# EAGLE design braids_v03_h405_upgrade (EAGLE 7.3.0)

## Sheet 1 of 2
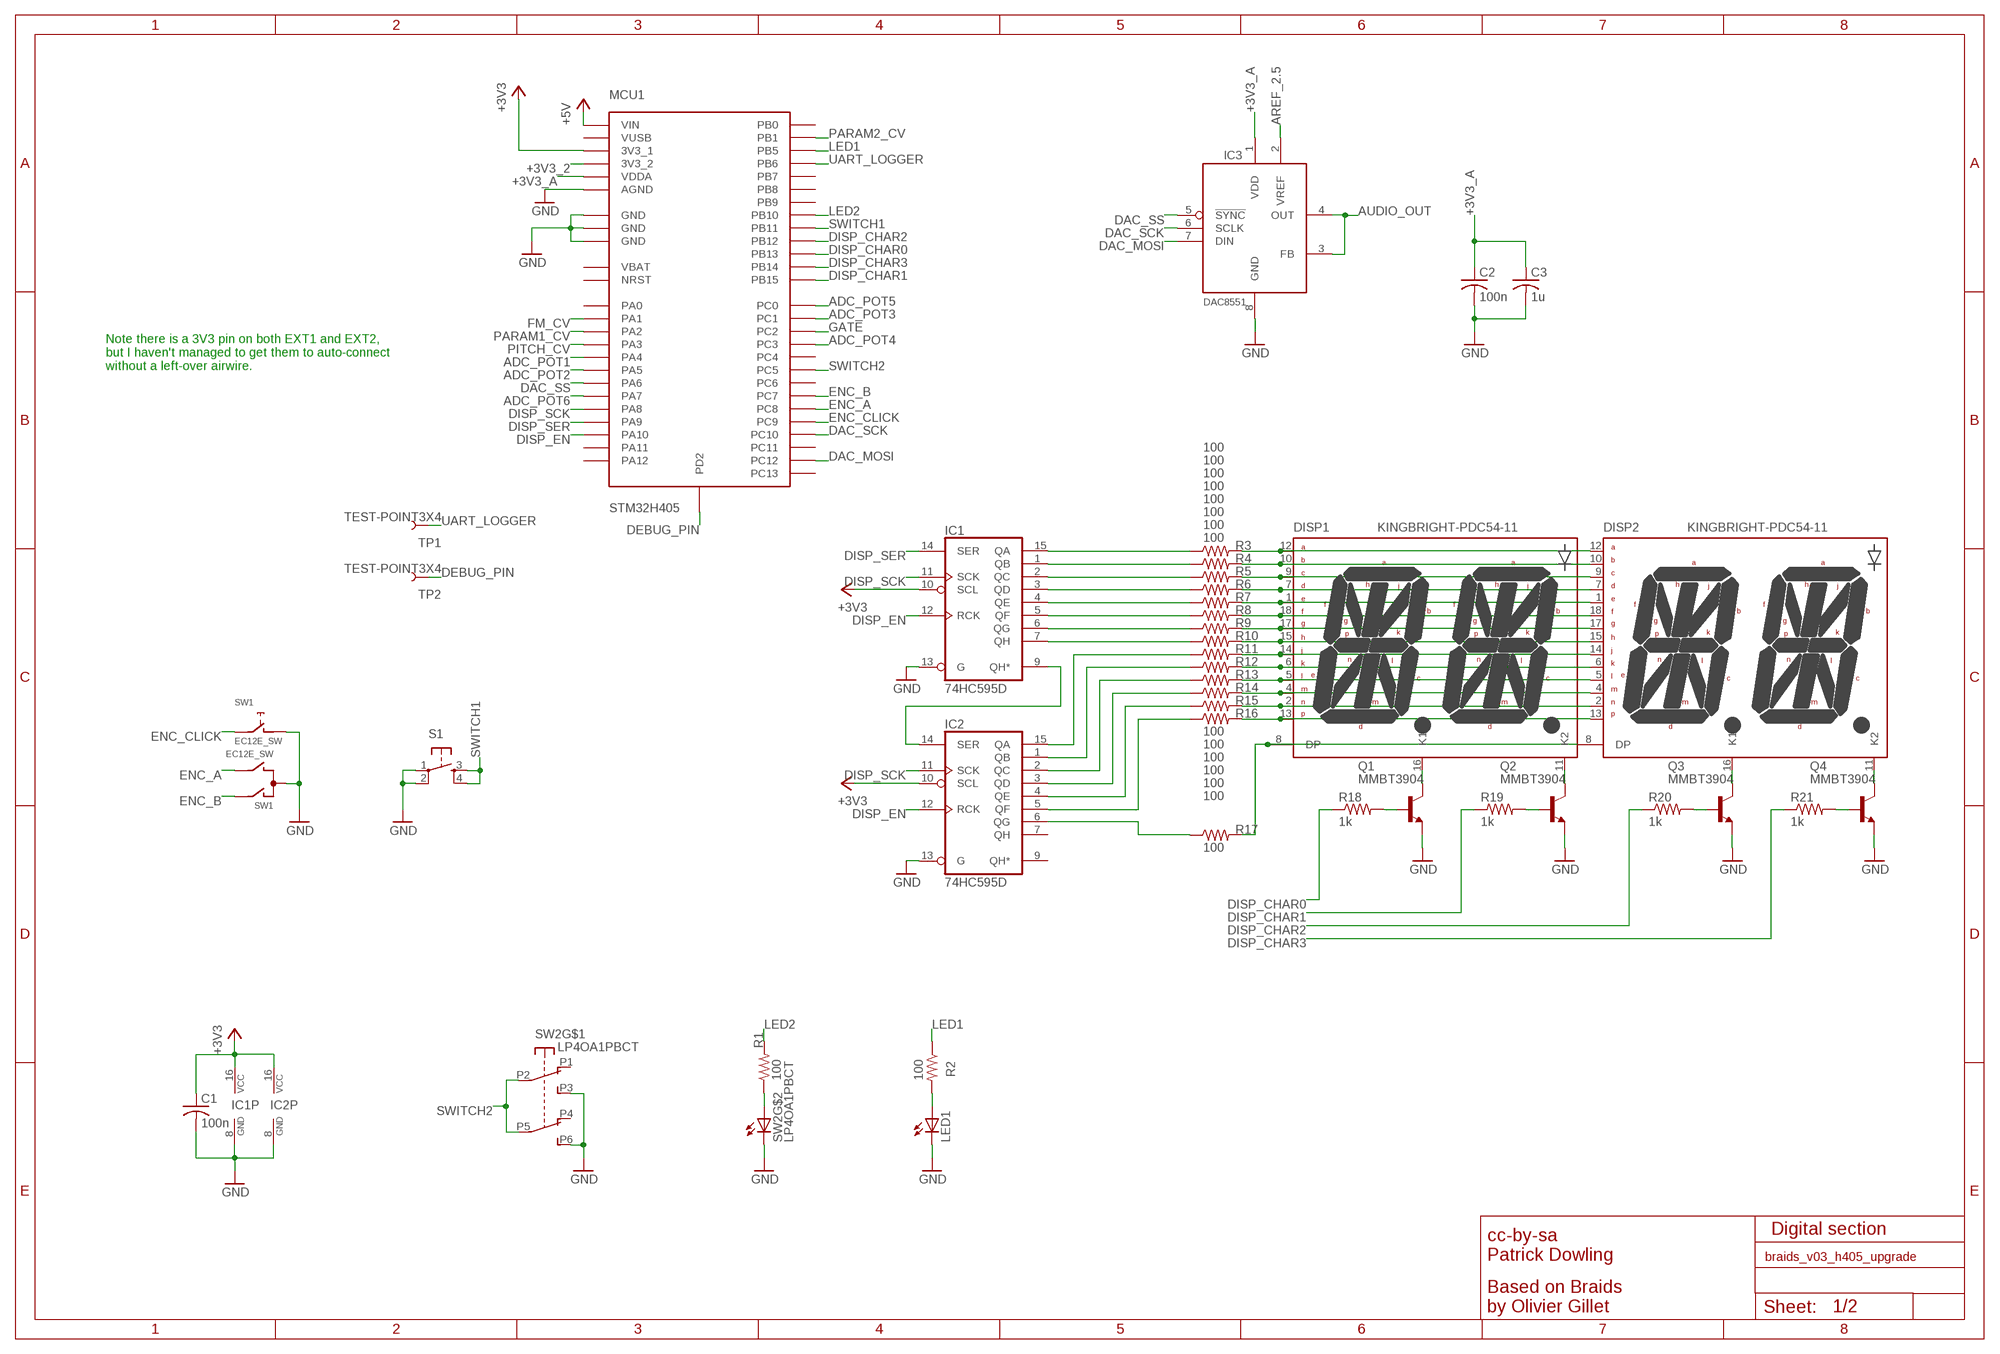
[diagram p0: schematic, sheet 1]

### Parts
C1  100n  C-USC0805  [C0805]
C2  100n  C-USC0805  [C0805]
C3  1u  C-USC0805  [C0805]
DISP1  KINGBRIGHT-PDC54-11  [PDC54]
DISP2  KINGBRIGHT-PDC54-11  [PDC54]
IC1  74HC595D  [SO16]
IC2  74HC595D  [SO16]
IC3  DAC8551  DAC855X  [MSOP-8]
LED1  LED3MM  [LED3MM]
MCU1  STM32H405  STM32H103  [STM32H103]
Q1  MMBT3904  MMBT3904LT1-NPN-SOT23-BEC  [SOT23-BEC]
Q2  MMBT3904  MMBT3904LT1-NPN-SOT23-BEC  [SOT23-BEC]
Q3  MMBT3904  MMBT3904LT1-NPN-SOT23-BEC  [SOT23-BEC]
Q4  MMBT3904  MMBT3904LT1-NPN-SOT23-BEC  [SOT23-BEC]
R1  100  R-US_R0805  [R0805]
R2  100  R-US_R0603  [R0603]
R3  100  R-US_R0603  [R0603]
R4  100  R-US_R0603  [R0603]
R5  100  R-US_R0603  [R0603]
R6  100  R-US_R0603  [R0603]
R7  100  R-US_R0603  [R0603]
R8  100  R-US_R0603  [R0603]
R9  100  R-US_R0603  [R0603]
R10  100  R-US_R0603  [R0603]
R11  100  R-US_R0603  [R0603]
R12  100  R-US_R0603  [R0603]
R13  100  R-US_R0603  [R0603]
R14  100  R-US_R0603  [R0603]
R15  100  R-US_R0603  [R0603]
R16  100  R-US_R0603  [R0603]
R17  100  R-US_R0603  [R0603]
R18  1k  R-US_R0603  [R0603]
R19  1k  R-US_R0603  [R0603]
R20  1k  R-US_R0603  [R0603]
R21  1k  R-US_R0603  [R0603]
S1  TAC_SWITCHPTH  [TACTILE-PTH]
SW1  EC12E_SW  [ALPS_EC12E_SW]
SW2  LP4OA1PBCT  [LP4OA1PBCT]
TP1  TEST-POINT3X4  [PAD.03X.04]
TP2  TEST-POINT3X4  [PAD.03X.04]

### Nets
+3V3: C1.1 IC1.10(SCL) IC1.16(VCC) IC2.10(SCL) IC2.16(VCC) MCU1.EXT1-5(3V3_1)
+3V3_2: MCU1.EXT2-5(3V3_2) ; also sheet 2
+3V3_A: C2.1 C3.1 IC3.1(VDD) MCU1.EXT2-1(VDDA) ; also sheet 2
+5V: MCU1.EXT2-26(VIN) ; also sheet 2
ADC_POT1: MCU1.EXT2-11(PA4) ; also sheet 2
ADC_POT2: MCU1.EXT1-18(PA5) ; also sheet 2
ADC_POT3: MCU1.EXT1-20(PC1) ; also sheet 2
ADC_POT4: MCU1.EXT2-9(PC3) ; also sheet 2
ADC_POT5: MCU1.EXT1-19(PC0) ; also sheet 2
ADC_POT6: MCU1.EXT1-22(PA7) ; also sheet 2
AREF_2.5: IC3.2(VREF) ; also sheet 2
AUDIO_OUT: IC3.3(FB) IC3.4(OUT) ; also sheet 2
DAC_MOSI: IC3.7(DIN) MCU1.EXT1-10(PC12)
DAC_SCK: IC3.6(SCLK) MCU1.EXT1-8(PC10)
DAC_SS: IC3.5(!SYNC) MCU1.EXT1-14(PA6)
DEBUG_PIN: MCU1.EXT1-11(PD2) TP2.P$1
DISP_CHAR0: MCU1.EXT2-16(PB13) R18.1
DISP_CHAR1: MCU1.EXT2-19(PB15) R19.1
DISP_CHAR2: MCU1.EXT2-17(PB12) R20.1
DISP_CHAR3: MCU1.EXT2-18(PB14) R21.1
DISP_EN: IC1.12(RCK) IC2.12(RCK) MCU1.EXT1-7(PA10)
DISP_SCK: IC1.11(SCK) IC2.11(SCK) MCU1.EXT1-2(PA8)
DISP_SER: IC1.14(SER) MCU1.EXT1-4(PA9)
ENC_A: MCU1.EXT2-22(PC8) SW1.B
ENC_B: MCU1.EXT2-21(PC7) SW1.A
ENC_CLICK: MCU1.EXT2-24(PC9) SW1.E
FM_CV: MCU1.EXT2-8(PA1) ; also sheet 2
GATE: MCU1.EXT2-2(PC2) ; also sheet 2
GND: C1.2 C2.2 C3.2 IC1.8(GND) IC1.13(G) IC2.8(GND) IC2.13(G) IC3.8(GND) LED1.K(C) MCU1.EXT1-6(GND) MCU1.EXT2-3(AGND) MCU1.EXT2-6(GND) MCU1.EXT2-25(GND) Q1.E Q2.E Q3.E Q4.E S1.1 S1.2 SW1.C SW1.D SW2.L2 SW2.P3(A3) SW2.P6(B3) ; also sheet 2
LED1: MCU1.EXT1-12(PB5) R2.1
LED2: MCU1.EXT2-14(PB10) R1.2
N$1: DISP1.16(K1) Q1.C
N$2: DISP1.11(K2) Q2.C
N$3: DISP2.16(K1) Q3.C
N$4: DISP2.11(K2) Q4.C
N$5: Q1.B R18.2
N$6: Q2.B R19.2
N$9: Q3.B R20.2
N$10: Q4.B R21.2
N$15: DISP1.12(A) DISP2.12(A) R3.2
N$16: DISP1.10(B) DISP2.10(B) R4.2
N$17: DISP1.9(C) DISP2.9(C) R5.2
N$18: DISP1.7(D) DISP2.7(D) R6.2
N$19: DISP1.1(E) DISP2.1(E) R7.2
N$20: DISP1.18(F) DISP2.18(F) R8.2
N$21: DISP1.17(G) DISP2.17(G) R9.2
N$22: DISP1.15(H) DISP2.15(H) R10.2
N$23: DISP1.14(J) DISP2.14(J) R11.2
N$24: DISP1.6(K) DISP2.6(K) R12.2
N$25: DISP1.5(L) DISP2.5(L) R13.2
N$26: DISP1.4(M) DISP2.4(M) R14.2
N$27: DISP1.2(N) DISP2.2(N) R15.2
N$28: DISP1.13(P) DISP2.13(P) R16.2
N$29: DISP1.8(DP) DISP2.8(DP) R17.2
N$30: IC1.7(QH) R10.1
N$31: IC1.9(QH*) IC2.14(SER)
N$32: IC1.15(QA) R3.1
N$33: IC1.1(QB) R4.1
N$34: IC1.2(QC) R5.1
N$35: IC1.3(QD) R6.1
N$36: IC1.4(QE) R7.1
N$37: IC1.5(QF) R8.1
N$38: IC1.6(QG) R9.1
N$39: IC2.15(QA) R11.1
N$40: IC2.1(QB) R12.1
N$41: IC2.2(QC) R13.1
N$42: IC2.3(QD) R14.1
N$43: IC2.4(QE) R15.1
N$44: IC2.5(QF) R16.1
N$46: IC2.6(QG) R17.1
N$47: LED1.A R2.2
N$48: R1.1 SW2.L1
PARAM1_CV: MCU1.EXT2-7(PA2) ; also sheet 2
PARAM2_CV: MCU1.EXT1-26(PB1) ; also sheet 2
PITCH_CV: MCU1.EXT2-10(PA3) ; also sheet 2
SWITCH1: MCU1.EXT2-15(PB11) S1.3 S1.4
SWITCH2: MCU1.EXT2-13(PC5) SW2.P2(A2) SW2.P5(B2)
UART_LOGGER: MCU1.EXT1-13(PB6) TP1.P$1
Unconnected: IC2.7(QH) IC2.9(QH*) MCU1.EXT1-1(PA11) MCU1.EXT1-3(PA12) MCU1.EXT1-9(PC11) MCU1.EXT1-15(PB7) MCU1.EXT1-16(PB8) MCU1.EXT1-17(PB9) MCU1.EXT1-21(PB0) MCU1.EXT1-23(VBAT) MCU1.EXT1-24(PC13) MCU1.EXT1-25(NRST) MCU1.EXT2-4(PA0) MCU1.EXT2-12(PC4) MCU1.EXT2-20(PC6) MCU1.EXT2-23(VUSB) SW1.GND1(G) SW1.GND2(G) SW2.P1(A1) SW2.P4(B1)

### Notes on the sheet
- Note there is a 3V3 pin on both EXT1 and EXT2,
  but I haven't managed to get them to auto-connect
  without a left-over airwire.
- Digital section
- cc-by-sa
  Patrick Dowling
- Based on Braids
  by Olivier Gillet

## Sheet 2 of 2
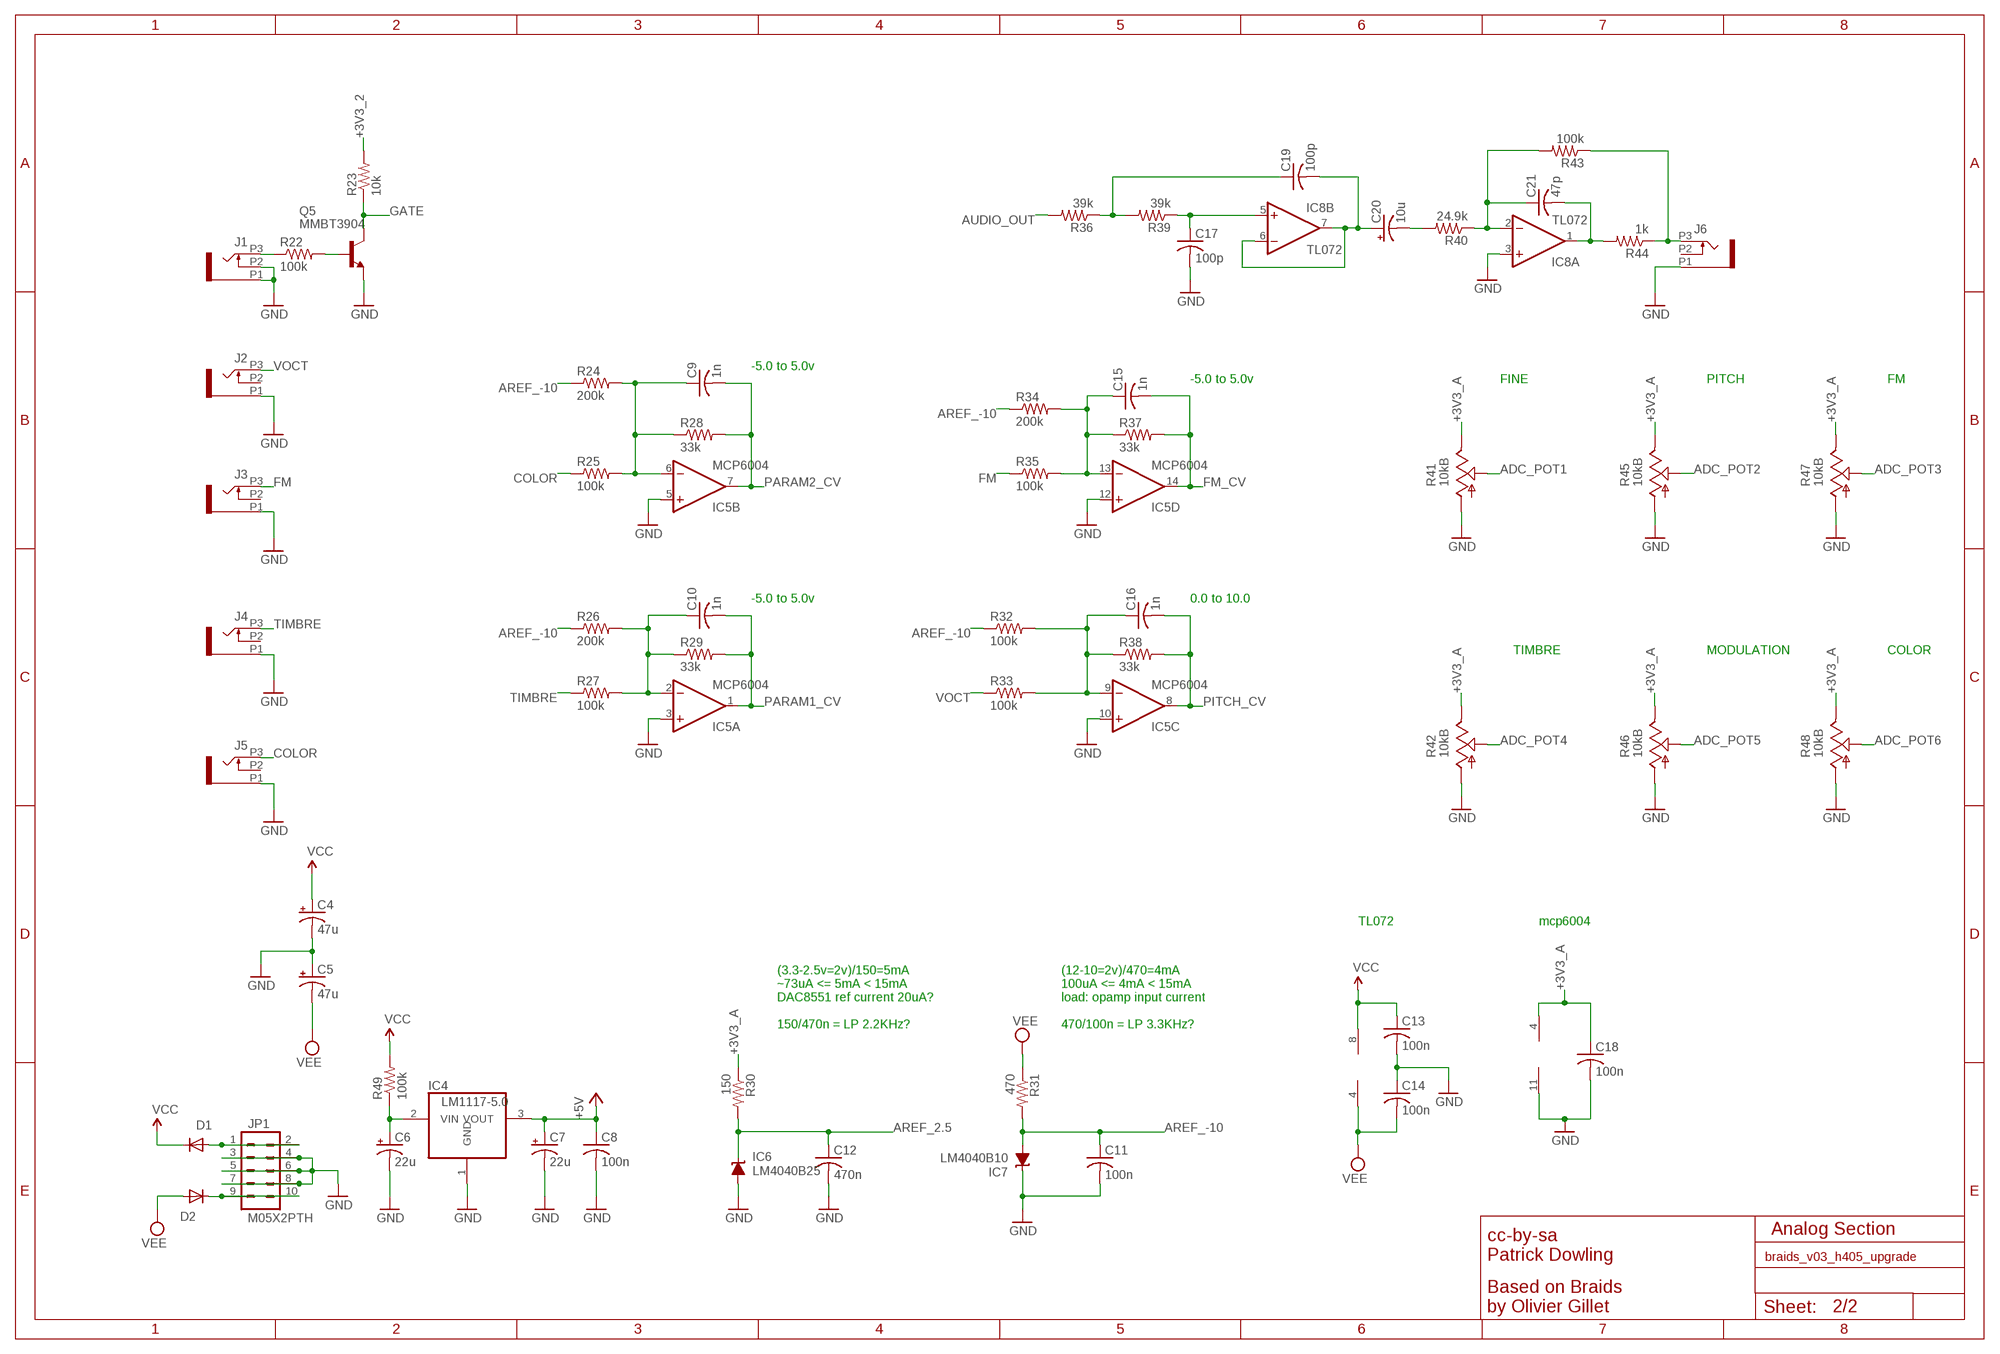
[diagram p1: schematic, sheet 2]

### Parts
C4  47u  CPOL-USD  [PANASONIC_D]
C5  47u  CPOL-USD  [PANASONIC_D]
C6  22u  CPOL-USC  [PANASONIC_C]
C7  22u  CPOL-USC  [PANASONIC_C]
C8  100n  C-USC0805  [C0805]
C9  1n  C-USC0805  [C0805]
C10  1n  C-USC0805  [C0805]
C11  100n  C-USC0805  [C0805]
C12  470n  C-USC0805  [C0805]
C13  100n  C-USC0805  [C0805]
C14  100n  C-USC0805  [C0805]
C15  1n  C-USC0805  [C0805]
C16  1n  C-USC0805  [C0805]
C17  100p  C-USC0805  [C0805]
C18  100n  C-USC0805  [C0805]
C19  100p  C-USC0805  [C0805]
C20  10u  CPOL-USE2-5  [E2-5]
C21  47p  C-USC0805  [C0805]
D1  1N5819HW  DIODE-SOD123  [SOD123]
D2  1N5819HW  DIODE-SOD123  [SOD123]
IC4  LM1117-5.0  REG1117T  [TO252]
IC5  MCP6004  TL074D  [SO14]
IC6  LM4040B25  LM4041B12DBZ  [DBZ_R-PDSO-G3]
IC7  LM4040B10  LM4041B12DBZ  [DBZ_R-PDSO-G3]
IC8  TL072  TL072D  [SO08]
J1  PJ301_THONKICONN6  [WQP_PJ_301M6]
J2  PJ301_THONKICONN6  [WQP_PJ_301M6]
J3  PJ301_THONKICONN6  [WQP_PJ_301M6]
J4  PJ301_THONKICONN6  [WQP_PJ_301M6]
J5  PJ301_THONKICONN6  [WQP_PJ_301M6]
J6  PJ301_THONKICONN6  [WQP_PJ_301M6]
JP1  M05X2PTH  [AVR_ICSP]
Q5  MMBT3904  MMBT3904LT1-NPN-SOT23-BEC  [SOT23-BEC]
R22  100k  R-US_R0805  [R0805]
R23  10k  R-US_R0805  [R0805]
R24  200k  R-US_R0805  [R0805]
R25  100k  R-US_R0805  [R0805]
R26  200k  R-US_R0805  [R0805]
R27  100k  R-US_R0805  [R0805]
R28  33k  R-US_R0805  [R0805]
R29  33k  R-US_R0805  [R0805]
R30  150  R-US_R0805  [R0805]
R31  470  R-US_R0805  [R0805]
R32  100k  R-US_R0805  [R0805]
R33  100k  R-US_R0805  [R0805]
R34  200k  R-US_R0805  [R0805]
R35  100k  R-US_R0805  [R0805]
R36  39k  R-US_R0805  [R0805]
R37  33k  R-US_R0805  [R0805]
R38  33k  R-US_R0805  [R0805]
R39  39k  R-US_R0805  [R0805]
R40  24.9k  R-US_R0805  [R0805]
R41  10kB  POT_USVERTICAL_PS  [ALPS_POT_VERTICAL_PS]
R42  10kB  POT_USVERTICAL_PS  [ALPS_POT_VERTICAL_PS]
R43  100k  R-US_R0805  [R0805]
R44  1k  R-US_R0805  [R0805]
R45  10kB  POT_USVERTICAL_PS  [ALPS_POT_VERTICAL_PS]
R46  10kB  POT_USVERTICAL_PS  [ALPS_POT_VERTICAL_PS]
R47  10kB  POT_USVERTICAL_PS  [ALPS_POT_VERTICAL_PS]
R48  10kB  POT_USVERTICAL_PS  [ALPS_POT_VERTICAL_PS]
R49  100k  R-US_R1206  [R1206]

### Nets
+3V3_2: R23.2 ; also sheet 1
+3V3_A: C18.1 IC5.4(P:V+) R30.1 R41.P$1(E) R42.P$1(E) R45.P$1(E) R46.P$1(E) R47.P$1(E) R48.P$1(E) ; also sheet 1
+5V: C7.+ C8.1 IC4.3(VOUT) ; also sheet 1
ADC_POT1: R41.P$2(S) ; also sheet 1
ADC_POT2: R45.P$2(S) ; also sheet 1
ADC_POT3: R47.P$2(S) ; also sheet 1
ADC_POT4: R42.P$2(S) ; also sheet 1
ADC_POT5: R46.P$2(S) ; also sheet 1
ADC_POT6: R48.P$2(S) ; also sheet 1
AREF_2.5: C12.1 IC6.1(C) R30.2 ; also sheet 1
AREF_-10: C11.1 IC7.2(A) R24.1 R26.1 R31.2 R32.1 R34.1
AUDIO_OUT: R36.2 ; also sheet 1
COLOR: J5.P3 R25.1
FM: J3.P3 R35.1
FM_CV: C15.2 IC5.14(D:OUT) R37.2 ; also sheet 1
GATE: Q5.C R23.1 ; also sheet 1
GATE_IN: Q5.B R22.2
GND: C4.- C5.+ C6.- C7.- C8.2 C11.2 C12.2 C13.2 C14.1 C17.2 C18.2 IC4.1(GND) IC5.3(A:+IN) IC5.5(B:+IN) IC5.10(C:+IN) IC5.11(P:V-) IC5.12(D:+IN) IC6.2(A) IC7.1(C) IC8.3(A:+IN) J1.P1 J1.P2 J2.P1 J3.P1 J4.P1 J5.P1 J6.P1 JP1.3 JP1.4 JP1.5 JP1.6 JP1.7 JP1.8 Q5.E R41.P$3(A) R42.P$3(A) R45.P$3(A) R46.P$3(A) R47.P$3(A) R48.P$3(A) ; also sheet 1
N$7: C6.+ IC4.2(VIN) R49.1
N$13: D2.C JP1.9 JP1.10
N$14: D1.A JP1.1 JP1.2
N$45: C9.1 IC5.6(B:-IN) R24.2 R25.2 R28.1
N$50: C15.1 IC5.13(D:-IN) R34.2 R35.2 R37.1
N$52: C10.1 IC5.2(A:-IN) R26.2 R27.2 R29.1
N$57: J1.P3 R22.1
N$63: C16.1 IC5.9(C:-IN) R32.2 R33.2 R38.1
N$67: C19.2 C20.+ IC8.6(B:-IN) IC8.7(B:OUT)
N$68: C20.- R40.2
N$69: C17.1 IC8.5(B:+IN) R39.1
N$71: C19.1 R36.1 R39.2
N$72: J6.P3 R43.1 R44.1
N$73: C21.2 IC8.1(A:OUT) R44.2
N$75: C21.1 IC8.2(A:-IN) R40.1 R43.2
PARAM1_CV: C10.2 IC5.1(A:OUT) R29.2 ; also sheet 1
PARAM2_CV: C9.2 IC5.7(B:OUT) R28.2 ; also sheet 1
PITCH_CV: C16.2 IC5.8(C:OUT) R38.2 ; also sheet 1
TIMBRE: J4.P3 R27.1
VCC: C4.+ C13.1 D1.C IC8.8(P:V+) R49.2
VEE: C5.- C14.2 D2.A IC8.4(P:V-) R31.1
VOCT: J2.P3 R33.1
Unconnected: J2.P2 J3.P2 J4.P2 J5.P2 J6.P2

### Notes on the sheet
- -5.0 to 5.0v
- -5.0 to 5.0v | FINE | PITCH | FM
- -5.0 to 5.0v | 0.0 to 10.0
- TIMBRE | MODULATION | COLOR
- TL072 | mcp6004
- (3.3-2.5v=2v)/150=5mA
  ~73uA <= 5mA < 15mA
  DAC8551 ref current 20uA?
  
  150/470n = LP 2.2KHz?
- (12-10=2v)/470=4mA
  100uA <= 4mA < 15mA
  load: opamp input current
  
  470/100n = LP 3.3KHz?
- Analog Section
- cc-by-sa
  Patrick Dowling
- Based on Braids
  by Olivier Gillet

## Library data of the parts
C1-C3 C8-C19 C21 = rcl:C-US: CAPACITOR, American symbol
C4-C7 C20 = rcl:CPOL-US: POLARIZED CAPACITOR, American symbol
D1 D2 = diode:DIODE-: DIODE
DISP1 DISP2 = og-display:KINGBRIGHT-PDC54-11: Kingbright PDC54-11GWA ; also compatible with LITE-On LTP-3784G or Avago HDSP-A27C
IC1 IC2 = 74xx-eu:74*595: 8-bit SHIFT REGISTER, output latch
IC3 = og-dac:DAC855X: 16-bit low-glitch DAC with 2's complement (8550) or unsigned code (8551)
IC4 = og-vreg:REG1117: 800mA and 1A Low Dropout (LDO) Positive Regulator 1.8V, 2.5V, 2.85V, 3.3V, 5V, and Adj
IC5 = gm-ics:TL074: OP AMP
IC6 IC7 = texas:LM4041: PRECISION MICROPOWER SHUNT VOLTAGE REFERENCE Source: http://focus.ti.com/lit/ds/slcs146e/slcs146e.pdf
IC8 = linear:TL072: OP AMP
J1-J6 = og-pj301:PJ301_THONKICONN
JP1 = og-header:M05X2: Header 5x2 Standard 10-pin dual row 0.1" header. Commonly used with AVR-ISP. Use with Spark Fun Electronics SKU: PRT-00778
LED1 = led:LED: LED OSRAM: - CHIPLED LG R971, LG N971, LY N971, LG Q971, LY Q971, LO R971, LY R971 LH N974, LH R974 LS Q976, LO Q976, LY Q976 LO Q996 - Hyper CHIPLED LW Q18S LB Q993, LB Q99A, LB R99A - SideLED LS A670, LO A670, LY A670, LG A670, LP A670 LB A673, LV A673, LT A673, LW A673 LH A674 LY A675 LS A676, LA A676, LO A676, LY A676, LW A676 LS A679, LY A679, LG A679 - Hyper Micro SIDELED® LS Y876, LA Y876, LO Y876, LY Y876 LT Y87S - SmartLED LW L88C, LW L88S LB L89C, LB L89S, LG L890 LS L89K, LO L89K, LY L89K LS L896, LA L896, LO L896, LY L896 - TOPLED LS T670, LO T670, LY T670, LG T670, LP T670 LSG T670, LSP T670, LSY T670, LOP T670, LYG T670 LG T671, LOG T671, LSG T671 LB T673, LV T673, LT T673, LW T673 LH T674 LS T676, LA T676, LO T676, LY T676, LB T676, LH T676, LSB T676, LW T676 LB T67C, LV T67C, LT T67C, LS T67K, LO T67K, LY T67K, LW E67C LS E67B, LA E67B, LO E67B, LY E67B, LB E67C, LV E67C, LT E67C LW T67C LS T679, LY T679, LG T679 LS T770, LO T770, LY T770, LG T770, LP T770 LB T773, LV T773, LT T773, LW T773 LH T774 LS E675, LA E675, LY E675, LS T675 LS T776, LA T776, LO T776, LY T776, LB T776 LHGB T686 LT T68C, LB T68C - Hyper Mini TOPLED® LB M676 - Mini TOPLED Santana® LG M470 LS M47K, LO M47K, LY M47K Source: http://www.osram.convergy.de LUXEON: - LUMILED® LXK2-PW12-R00, LXK2-PW12-S00, LXK2-PW14-U00, LXK2-PW14-V00 LXK2-PM12-R00, LXK2-PM12-S00, LXK2-PM14-U00 LXK2-PE12-Q00, LXK2-PE12-R00, LXK2-PE12-S00, LXK2-PE14-T00, LXK2-PE14-U00 LXK2-PB12-K00, LXK2-PB12-L00, LXK2-PB12-M00, LXK2-PB14-N00, LXK2-PB14-P00, LXK2-PB14-Q00 LXK2-PR12-L00, LXK2-PR12-M00, LXK2-PR14-Q00, LXK2-PR14-R00 LXK2-PD12-Q00, LXK2-PD12-R00, LXK2-PD12-S00 LXK2-PH12-R00, LXK2-PH12-S00 LXK2-PL12-P00, LXK2-PL12-Q00, LXK2-PL12-R00 Source: www.luxeon.com KINGBRIGHT: KA-3528ASYC Source: www.kingbright.com
MCU1 = olimex-stm32h:STM32H103: Olimex STM32H103 and H405
Q1-Q5 = transistor:*-NPN-: NPN Transistror BF959 corrected 2008.03.06
R1-R40 R43 R44 R49 = rcl:R-US_: RESISTOR, American symbol
R41 R42 R45-R48 = pot-alps:POT_US
S1 = SparkFun:TAC_SWITCH: Momentary Switch Button commonly used for reset or general input. Spark Fun Electronics SKU : COM-00097
SW1 = og-encoder:EC12E_SW: ALPS rotary Encoder EC12E series with switch
SW2 = og-switch:LP4OA1PBCT
TP1 TP2 = SparkFun-Passives:TEST-POINT: Bare copper test points for troubleshooting or ICT

## Board
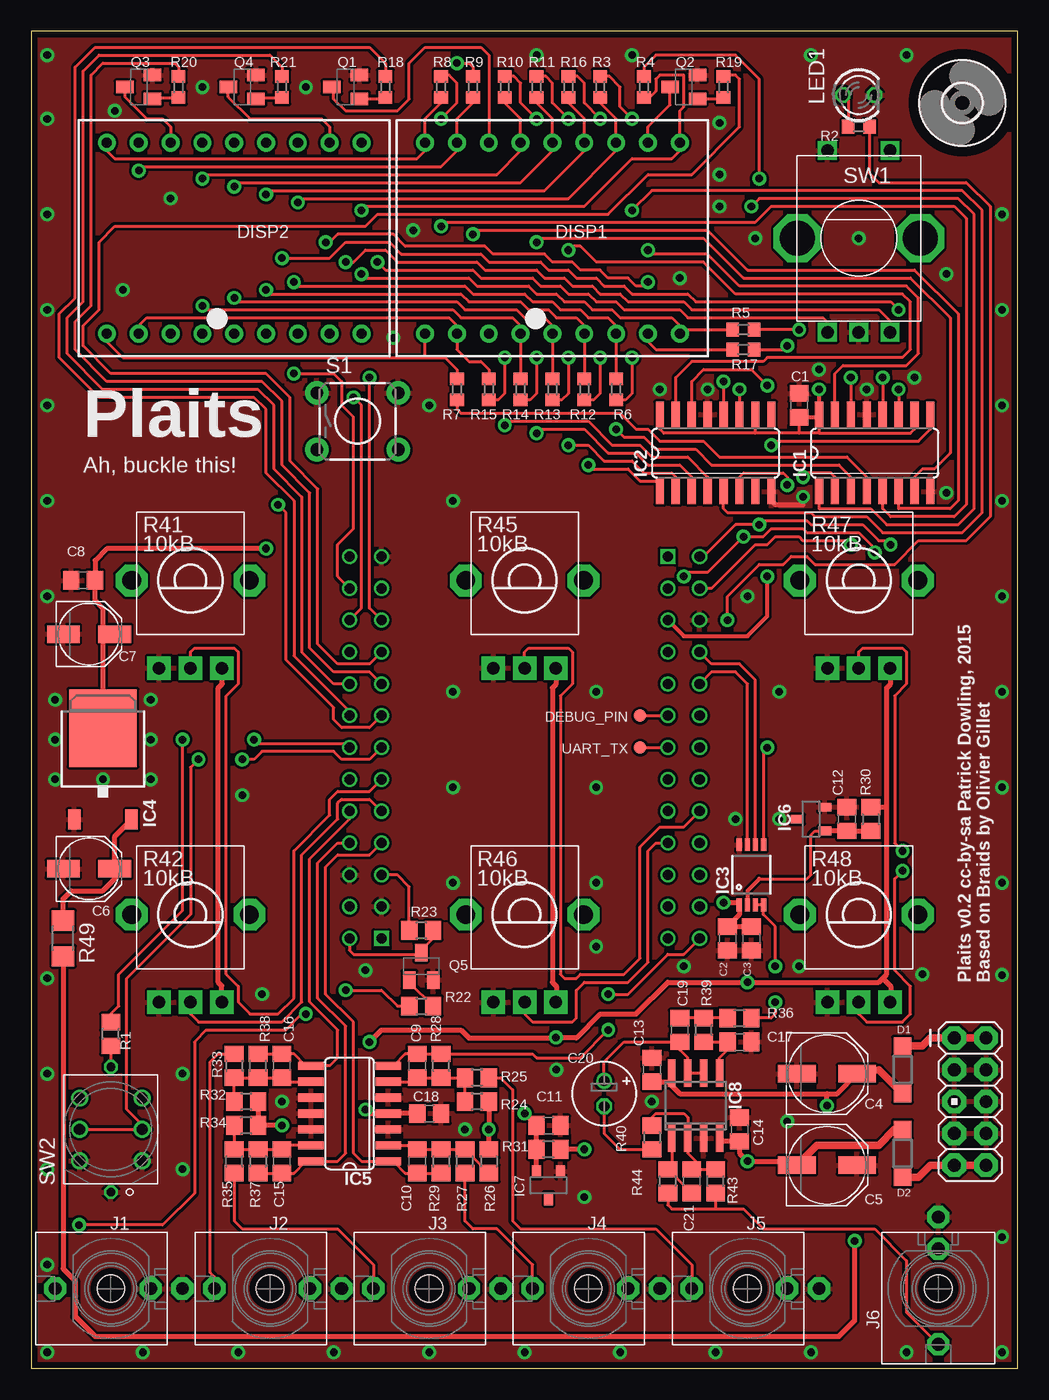
[diagram p2: board, top side]
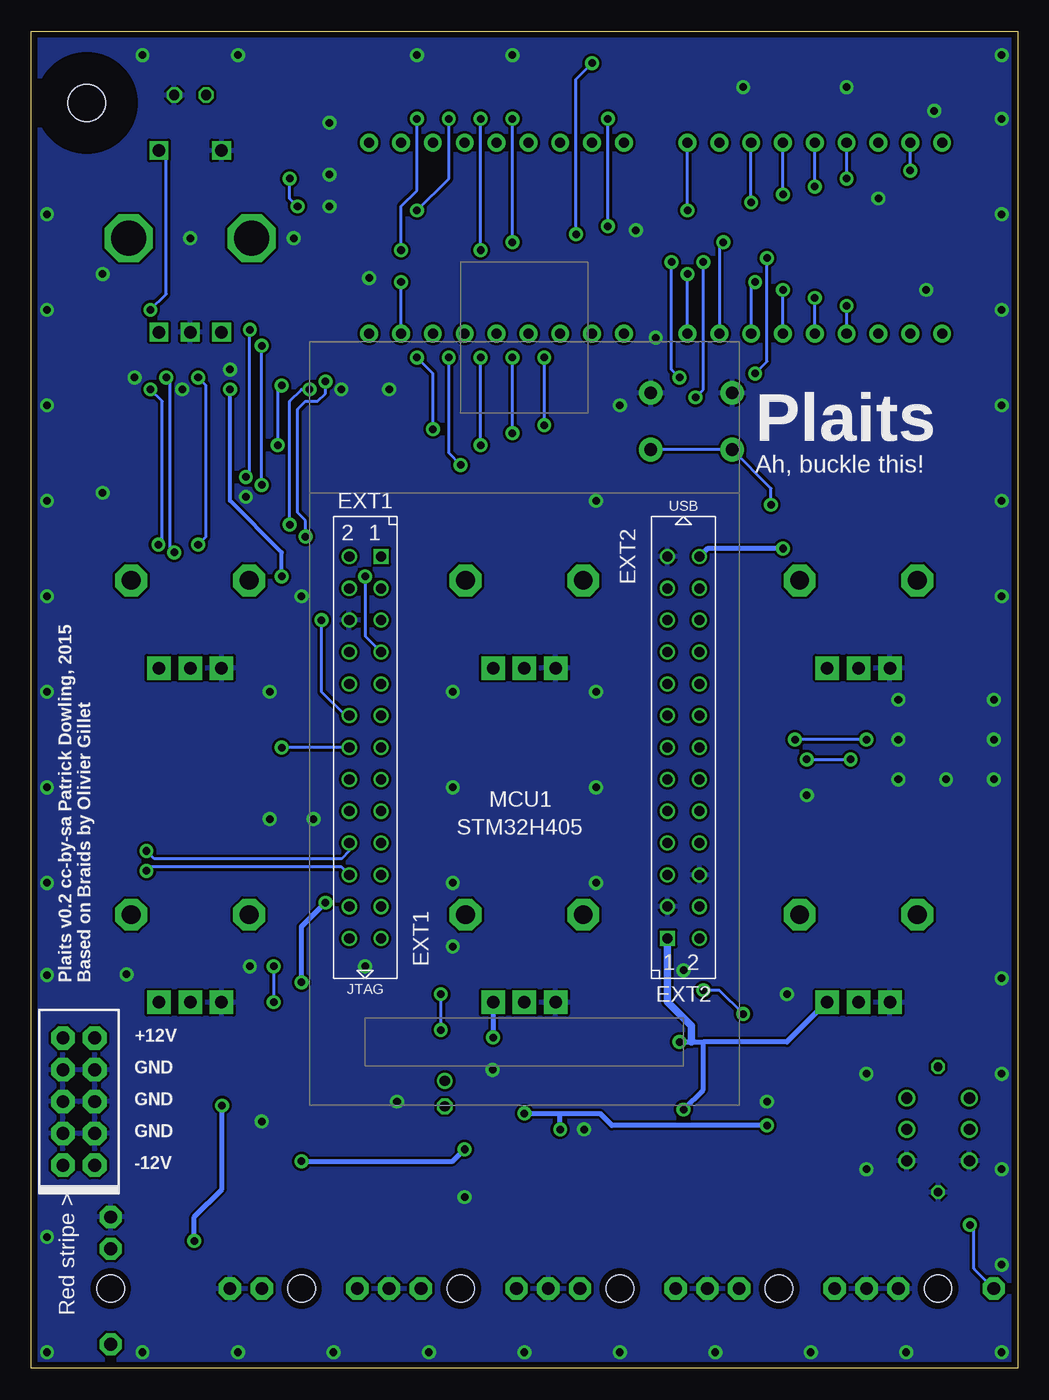
[diagram p3: board, bottom side, seen from below]

Size 78.72 x 106.68 mm. Coordinates in mm from the lower left corner, seen from the top.
Outline: 0,0 78.72,0 78.72,106.68 0,106.68 0,0
Copper layers (1*16): Top 0.035mm / dielectric 1.5mm / Bottom 0.035mm
Design rules "PCBCart-Standard *": minimum track width 8mil, minimum drill 0.4mm, track to track 8mil, track to pad 8mil, pad to pad 8mil, via to via 8mil, smd to smd 8mil, copper to edge 20mil, drill to drill 8mil, minimum pad ring 8mil, minimum via ring 10mil, stop-mask expansion 3mil, vias tented up to drill 25mil, thermal gap 8mil

### Footprints (pad centres in the part's own frame; a part is rotated, then mirrored left to right if it is on the bottom)
C0805 = smd 1.3 x 1.5: 1 -0.95,0; 2 0.95,0
PANASONIC_D = smd 3 x 1.4: + 2.4,0; - -2.4,0
PANASONIC_C = smd 2.6 x 1.4: + 2.05,0; - -2.05,0
E2-5 = drill 0.813 pad 1.27: + -1.016,0 | drill 0.813 pad 1.27 octagon: - 1.016,0
SOD123 = smd 1.4 x 1.4: A 1.9,0; C -1.9,0
PDC54 = drill 0.8 pad 1.422: 1 -10.16,-7.62; 2 -7.62,-7.62; 3 -5.08,-7.62; 4 -2.54,-7.62; 5 0,-7.62; 6 2.54,-7.62; 7 5.08,-7.62; 8 7.62,-7.62; 9 10.16,-7.62; 10 10.16,7.62; 11 7.62,7.62; 12 5.08,7.62; 13 2.54,7.62; 14 0,7.62; 15 -2.54,7.62; 16 -5.08,7.62; 17 -7.62,7.62; 18 -10.16,7.62
SO16 = smd 0.66 x 2.032: 1 -4.445,-3.073; 2 -3.175,-3.073; 3 -1.905,-3.073; 4 -0.635,-3.073; 5 0.635,-3.073; 6 1.905,-3.073; 7 3.175,-3.073; 8 4.445,-3.073; 9 4.445,3.073; 10 3.175,3.073; 11 1.905,3.073; 12 0.635,3.073; 13 -0.635,3.073; 14 -1.905,3.073; 15 -3.175,3.073; 16 -4.445,3.073
MSOP-8 = smd 0.41 x 1.02: 1 -0.975,-2.4; 2 -0.325,-2.4; 3 0.325,-2.4; 4 0.975,-2.4; 5 0.975,2.4; 6 0.325,2.4; 7 -0.325,2.4; 8 -0.975,2.4
TO252 = smd 1 x 1.6: 1 -2.28,-4.8; 2 2.28,-4.8 | smd 5.4 x 6.2: 3 0,2.5
SO14 = smd 0.66 x 2.032: 1 -3.81,-3.073; 2 -2.54,-3.073; 3 -1.27,-3.073; 4 0,-3.073; 5 1.27,-3.073; 6 2.54,-3.073; 7 3.81,-3.073; 8 3.81,3.073; 9 2.54,3.073; 10 1.27,3.073; 11 0,3.073; 12 -1.27,3.073; 13 -2.54,3.073; 14 -3.81,3.073
DBZ_R-PDSO-G3 = smd 0.7 x 1: 1 -0.95,-1.1; 2 0.95,-1.1; 3 0,1.1
SO08 = smd 0.6 x 2.2: 1 -1.905,-2.6; 2 -0.635,-2.6; 3 0.635,-2.6; 4 1.905,-2.6; 5 1.905,2.6; 6 0.635,2.6; 7 -0.635,2.6; 8 -1.905,2.6
WQP_PJ_301M6 = drill 1.016 pad 1.778 octagon: P1 0,-5.715; P2 0,-3.175; P3 0,4.445 | hole 2.2: 0,0
AVR_ICSP = drill 1.016 pad 1.88 octagon: 1 -1.27,5.08; 2 1.27,5.08; 3 -1.27,2.54; 4 1.27,2.54; 5 -1.27,0; 6 1.27,0; 7 -1.27,-2.54; 8 1.27,-2.54; 9 -1.27,-5.08; 10 1.27,-5.08
LED3MM = drill 0.813 octagon: A -1.27,0; K 1.27,0
STM32H103 = drill 0.8 square: EXT1-1 11.43,-15.24; EXT2-1 -11.43,15.24 | drill 0.8: EXT1-2 13.97,-15.24; EXT1-3 11.43,-12.7; EXT1-4 13.97,-12.7; EXT1-5 11.43,-10.16; EXT1-6 13.97,-10.16; EXT1-7 11.43,-7.62; EXT1-8 13.97,-7.62; EXT1-9 11.43,-5.08; EXT1-10 13.97,-5.08; EXT1-11 11.43,-2.54; EXT1-12 13.97,-2.54; EXT1-13 11.43,0; EXT1-14 13.97,0; EXT1-15 11.43,2.54; EXT1-16 13.97,2.54; EXT1-17 11.43,5.08; EXT1-18 13.97,5.08; EXT1-19 11.43,7.62; EXT1-20 13.97,7.62; EXT1-21 11.43,10.16; EXT1-22 13.97,10.16; EXT1-23 11.43,12.7; EXT1-24 13.97,12.7; EXT1-25 11.43,15.24; EXT1-26 13.97,15.24; EXT2-2 -13.97,15.24; EXT2-3 -11.43,12.7; EXT2-4 -13.97,12.7; EXT2-5 -11.43,10.16; EXT2-6 -13.97,10.16; EXT2-7 -11.43,7.62; EXT2-8 -13.97,7.62; EXT2-9 -11.43,5.08; EXT2-10 -13.97,5.08; EXT2-11 -11.43,2.54; EXT2-12 -13.97,2.54; EXT2-13 -11.43,0; EXT2-14 -13.97,0; EXT2-15 -11.43,-2.54; EXT2-16 -13.97,-2.54; EXT2-17 -11.43,-5.08; EXT2-18 -13.97,-5.08; EXT2-19 -11.43,-7.62; EXT2-20 -13.97,-7.62; EXT2-21 -11.43,-10.16; EXT2-22 -13.97,-10.16; EXT2-23 -11.43,-12.7; EXT2-24 -13.97,-12.7; EXT2-25 -11.43,-15.24; EXT2-26 -13.97,-15.24
SOT23-BEC = smd 1 x 1.4: B -0.95,-1.1; C 0,1.1; E 0.95,-1.1
R0805 = smd 1.3 x 1.5: 1 -0.95,0; 2 0.95,0
R0603 = smd 1 x 1.1: 1 -0.85,0; 2 0.85,0
ALPS_POT_VERTICAL_PS = drill 1 pad 1.88 square: P$1 -2.5,7; P$2 0,7; P$3 2.5,7 | drill 1.5 pad 2.54 octagon: P$4 -4.7,0; P$5 4.7,0
R1206 = smd 1.6 x 1.803: 1 -1.422,0; 2 1.422,0
TACTILE-PTH = drill 1.016 pad 1.88: 1 -3.251,2.261; 2 3.251,2.261; 3 -3.251,-2.261; 4 3.251,-2.261
ALPS_EC12E_SW = drill 1 square: A -2.5,-7.5; B 2.5,-7.5; C 0,-7.5; D -2.5,7; E 2.5,7 | drill 2.8 octagon: GND1 -4.9,0; GND2 4.9,0
LP4OA1PBCT = drill 0.7 octagon: L1 5,0; L2 -5,0 | drill 0.9: P1 2.5,2.5; P2 0,2.5; P3 -2.5,2.5; P4 2.5,-2.5; P5 0,-2.5; P6 -2.5,-2.5
PAD.03X.04 = smd 1.016 x 1.016: P$1 0,0
3,0 = hole 3: 0,0

### Placement (x,y rotation side)
C1  61.28,76.83 90 top
C2  55.56,34.29 270 top
C3  57.47,34.29 270 top
C4  63.5,23.5 0 top
C5  63.5,16.19 0 top
C6  4.6,39.85 0 top
C7  4.6,58.58 0 top
C8  4.13,62.87 180 top
C9  30.8,24.13 90 top
C10  30.8,16.51 270 top
C11  41.27,19.37 0 top
C12  65.09,43.81 90 top
C13  49.53,23.81 90 top
C14  56.52,19.05 270 top
C15  20,16.51 270 top
C16  20,24.13 90 top
C17  56.52,26.04 0 top
C18  31.75,20.32 0 top
C19  51.75,26.99 270 top
C20  45.72,21.91 270 top
C21  52.7,14.92 270 top
D1  69.53,23.81 90 top
D2  69.53,17.14 90 top
DISP1  41.59,90.17 0 top
DISP2  16.19,90.17 0 top
IC1  67.31,73.03 0 top
IC2  54.61,73.03 0 top
IC3  57.47,39.37 0 top
IC4  5.71,48.58 0 top
IC5  25.4,20.32 90 top
IC6  62.23,43.81 90 top
IC7  41.27,14.61 180 top
IC8  53.02,20.95 0 top
J1  6.35,6.35 90 top
J2  19.05,6.35 90 top
J3  31.75,6.35 90 top
J4  44.45,6.35 90 top
J5  57.15,6.35 90 top
J6  72.39,6.35 180 top
JP1  74.93,21.27 0 top
LED1  66.04,101.6 0 top
MCU1  39.37,49.53 180 bottom
Q1  25.08,102.23 90 top
Q2  52.07,102.23 90 top
Q3  8.57,102.23 90 top
Q4  16.83,102.23 90 top
Q5  31.11,32.07 0 top
R1  6.35,26.67 90 top
R2  66.04,99.06 180 top
R3  45.4,102.23 270 top
R4  48.9,102.23 270 top
R5  56.83,82.87 180 top
R6  46.67,78.11 90 top
R7  33.97,78.11 90 top
R8  32.7,102.23 270 top
R9  35.24,102.23 270 top
R10  37.78,102.23 270 top
R11  40.32,102.23 270 top
R12  44.13,78.11 90 top
R13  41.59,78.11 90 top
R14  39.05,78.11 90 top
R15  36.51,78.11 90 top
R16  42.86,102.23 270 top
R17  56.83,81.28 180 top
R18  28.26,102.23 270 top
R19  55.24,102.23 270 top
R20  11.75,102.23 270 top
R21  20,102.23 270 top
R22  31.11,28.89 0 top
R23  31.11,34.92 180 top
R24  35.56,21.27 180 top
R25  35.56,23.18 180 top
R26  36.51,16.51 270 top
R27  34.61,16.51 90 top
R28  32.7,24.13 90 top
R29  32.7,16.51 270 top
R30  66.99,43.81 270 top
R31  41.27,17.46 180 top
R32  17.14,21.27 180 top
R33  16.19,24.13 270 top
R34  17.14,19.37 180 top
R35  16.19,16.51 90 top
R36  56.52,27.94 0 top
R37  18.1,16.51 270 top
R38  18.1,24.13 90 top
R39  53.66,26.99 90 top
R40  49.53,18.41 270 top
R41  12.7,62.87 180 top
R42  12.7,36.2 180 top
R43  54.61,14.92 90 top
R44  50.8,14.92 90 top
R45  39.37,62.87 180 top
R46  39.37,36.2 180 top
R47  66.04,62.87 180 top
R48  66.04,36.2 180 top
R49  2.54,34.29 270 top
S1  26.04,75.56 0 top
SW1  66.04,90.17 0 top
SW2  6.35,19.05 90 top
TP1  48.58,49.53 90 top
TP2  48.58,52.07 270 top
U$1  [3,0]  74.3,100.97 0 top
U$2  [EURORACK_TEMPLATE]  -1.27,117.47 0 top  (outside the outline)

### Tracks (layer width: path | path; a pad name or v marks a point on that pad's centre or on a via)
+3V3  (via drill 0.6)
  Top 0.254: IC2.16 50.16,74.93 50.48,74.61 57.78,74.61 | 62.87,74.61 70.17,74.61 70.48,74.93 IC1.10 | IC1.16 62.87,74.61 | 62.87,74.61 61.28,74.61 | 61.28,74.61 C1.1 | 61.28,74.61 57.78,74.61 | 57.78,74.61 IC2.10
  Top 0.305: C1.1 62.65,75.89 | v62.87,78.11 IC1.16 | v58.74,63.18 58.74,60.01 57.15,58.42 52.07,58.42 MCU1.EXT1-5
  Top 0.406: 62.65,75.89 IC1.16
  Bottom 0.305: v62.87,78.11 62.87,69.22 58.74,65.09 v58.74,63.18
+3V3_2
  Top 0.254: R23.2 30.16,38.41 29.21,39.37 MCU1.EXT2-5
+3V3_A  (via drill 0.6)
  Top 0.254: R42.P$1 15.24,29.23
  Top 0.305: 56.31,37.15 IC3.1
  Top 0.406: C18.1 IC5.4 26.99,20.32 v26.67,20.64 | v55.24,37.15 56.31,37.15 | R42.P$1 15.2,30.52 14.92,30.8 14.92,54.29 15.24,54.61 15.24,55.83 R41.P$1 | R45.P$1 41.87,54.57 41.59,54.29 41.59,30.8 41.91,30.48 41.91,29.23 R46.P$1 | v26.99,26.04 27.94,26.99 34.29,26.99 34.92,26.35 41.83,26.35 v41.87,26.39 41.91,26.35 43.5,26.35 45.4,28.26 48.26,28.26 50.8,30.8 v57.15,30.8 67.63,30.8 67.94,31.11 | 67.94,31.11 68.26,31.43 68.26,44.77 | 68.26,44.77 68.26,54.29 68.58,54.61 68.58,55.83 R47.P$1 | 67.94,31.11 68.58,30.48 68.58,29.23 R48.P$1 | C3.1 C2.1 56.49,36.17 IC3.1 | R30.1 68.26,44.77
  Bottom 0.254: 15.26,29.2 R42.P$1
  Bottom 0.406: 15.26,29.2 18.41,26.04 25.08,26.04 | R46.P$1 v41.87,26.39 | v57.15,30.8 57.15,35.24 v55.24,37.15 | v26.67,20.64 25.08,22.23 25.08,26.04 | v26.99,26.04 26.04,26.04 25.08,26.04
  Bottom 0.61: MCU1.EXT2-1 27.94,29.21 26.04,27.3 26.04,26.04
+5V  (via drill 0.6)
  Top 0.406: v18.73,65.41 6.03,65.41 5.08,64.45 5.08,62.97 C8.1 5.08,62.76 5.08,61.28 5.71,60.64 5.71,58.42 | 5.71,58.42 6.5,58.42 C7.+ 5.87,58.58 5.71,58.42 | 5.71,58.42 IC4.3
  Bottom 0.406: v18.73,65.41 24.77,65.41 MCU1.EXT2-26
ADC_POT1
  Top 0.254: R41.P$2 12.7,57.15 13.02,57.47 16.19,57.47 16.51,57.15 16.51,54.61 15.56,53.66 15.56,31.43 16.51,30.48 16.51,29.21 17.46,28.26 19.68,28.26 20.95,29.53 20.95,41.27 23.81,44.13 23.81,45.4 24.45,46.04 26.99,46.04 MCU1.EXT2-11
ADC_POT2
  Top 0.254: R45.P$2 39.37,57.15 39.69,57.47 42.86,57.47 43.18,57.15 43.18,54.61 42.23,53.66 42.23,31.43 42.55,31.11 43.5,31.11 43.81,31.43 47.31,31.43 48.58,32.7 48.58,41.59 50.16,43.18 52.07,43.18 MCU1.EXT1-18
ADC_POT3  (via drill 0.6)
  Top 0.254: R47.P$2 66.04,57.15 66.36,57.47 69.53,57.47 69.85,57.15 69.85,54.61 68.9,53.66 68.9,41.91 v69.53,41.27
  Bottom 0.254: MCU1.EXT1-20 53.34,41.27 53.98,40.64 68.9,40.64 v69.53,41.27
ADC_POT4
  Top 0.254: R42.P$2 12.7,28.26 13.34,27.62 20,27.62 21.59,29.21 21.59,40.96 24.45,43.81 24.45,45.09 24.77,45.4 26.99,45.4 MCU1.EXT2-9
ADC_POT5
  Top 0.254: R46.P$2 39.37,28.26 40.01,27.62 43.18,27.62 43.5,27.94 43.5,30.16 44.13,30.8 47.62,30.8 49.21,32.38 49.21,41.27 49.85,41.91 MCU1.EXT1-19
ADC_POT6  (via drill 0.6)
  Top 0.254: R48.P$2 66.04,28.26 66.67,27.62 69.53,27.62 70.17,28.26 70.17,30.48 68.9,31.75 68.9,39.05 v69.53,39.69
  Bottom 0.254: MCU1.EXT1-22 53.98,40.01 69.22,40.01 v69.53,39.69
AREF_2.5
  Top 0.254: IC3.2 | 58.1,39.05 61.91,39.05 62.23,39.37 62.23,42.55 62.55,42.86 IC6.1
  Top 0.305: IC3.2 57.15,38.1 58.1,39.05
  Top 0.406: R30.2 C12.1 65.3,42.86 IC6.1
AREF_-10  (via drill 0.6)
  Top 0.406: R32.1 R34.1 v20,19.37 | R24.1 v36.51,19.05 R26.1 | R31.2 C11.1 v39.37,20.32 | R31.2 40.64,17.78 | IC7.2 R31.2
  Bottom 0.406: v20,19.37 32.38,19.37 33.34,20.32 36.51,20.32 | v39.37,20.32 36.51,20.32 | v36.51,19.05 36.51,20.32
AUDIO_OUT  (via drill 0.6)
  Top 0.254: IC3.3 IC3.4 58.42,36.95 58.42,36.2 59.37,35.24 v59.37,32.07 | v59.37,29.21 59.37,28.26 59.05,27.94 R36.2
  Bottom 0.254: v59.37,32.07 v59.37,29.21
COLOR
  Top 0.254: R25.1 37.47,23.18 38.42,22.23 38.42,11.75 39.05,11.11 49.85,11.11 52.7,8.26 J5.P3
DAC_MOSI
  Top 0.254: IC3.7 57.14,54.6 57.15,54.61 56.2,55.56 54.29,55.56 MCU1.EXT1-10
DAC_SCK
  Top 0.254: IC3.6 57.79,41.9 57.78,41.91 57.78,54.93 56.52,56.2 54.29,56.2 MCU1.EXT1-8
DAC_SS  (via drill 0.6)
  Top 0.254: v58.74,49.53 58.42,49.21 58.42,41.79 IC3.5
  Bottom 0.254: MCU1.EXT1-14 v58.74,49.53
DEBUG_PIN
  Top 0.254: TP2.P$1 MCU1.EXT1-11
DISP_CHAR0
  Top 0.254: R18.1 28.26,104.14 26.99,105.41 5.08,105.41 3.49,103.82 3.49,85.41 2.22,84.14 2.22,80.64 5.4,77.47 17.78,77.47 18.73,76.52 18.73,71.44 20.95,69.22 20.95,56.83 25.4,52.39 MCU1.EXT2-16
DISP_CHAR1
  Top 0.254: R19.1 55.35,103.19 56.2,103.19 56.52,102.87 56.52,99.06 52.7,95.25 49.21,95.25 46.04,92.08 27.62,92.08 26.67,91.12 6.67,91.12 5.4,89.85 5.4,84.45 4.13,83.19 4.13,81.6 6.35,79.38 18.73,79.38 20.64,77.47 20.64,72.39 22.86,70.17 22.86,57.78 24.45,56.2 26.99,56.2 MCU1.EXT2-19
DISP_CHAR2
  Top 0.254: R20.1 11.75,103.82 11.43,104.14 5.71,104.14 4.76,103.19 4.76,84.77 3.49,83.5 3.49,81.28 6.03,78.74 18.41,78.74 20,77.15 20,72.07 22.23,69.85 22.23,57.47 24.13,55.56 26.99,55.56 MCU1.EXT2-17
DISP_CHAR3
  Top 0.254: R21.1 20,103.82 19.05,104.78 5.4,104.78 4.13,103.5 4.13,85.09 2.86,83.82 2.86,80.96 5.71,78.11 18.1,78.11 19.37,76.83 19.37,71.75 21.59,69.53 21.59,57.15 24.13,54.61 MCU1.EXT2-18
DISP_EN  (via drill 0.6)
  Top 0.254: v67.94,79.06 IC1.12 | v67.31,65.09 67.31,65.41 66.04,66.67 61.91,66.67 61.59,66.99 59.05,66.99 58.42,66.36 v56.83,66.36 53.98,63.5 52.39,63.5 v52.07,63.18 | v55.24,78.74 IC2.12
  Bottom 0.254: v67.31,65.09 67.63,65.41 67.63,78.74 v67.94,79.06 | v56.83,66.36 56.83,67.63 57.47,68.26 57.47,76.52 56.83,77.15 55.88,77.15 55.24,77.79 v55.24,78.74 | v52.07,63.18 52.07,58.42 MCU1.EXT1-7
DISP_SCK  (via drill 0.6)
  Top 0.254: v69.22,78.11 IC1.11 | v68.58,65.72 68.26,66.04 67.63,66.04 66.36,67.31 62.23,67.31 61.91,67.63 58.42,67.63 v58.1,67.31 56.2,67.31 53.66,64.77 MCU1.EXT1-2 | v56.52,78.11 IC2.11
  Bottom 0.254: v68.58,65.72 68.26,66.04 68.26,77.15 v69.22,78.11 | v58.1,67.31 58.1,77.15 57.15,78.11 v56.52,78.11
DISP_SER  (via drill 0.6)
  Top 0.254: v65.41,79.06 IC1.14 | v65.41,65.72 65.09,66.04 61.59,66.04 61.28,66.36 59.37,66.36 58.74,65.72 57.78,65.72 54.29,62.23 MCU1.EXT1-4
  Bottom 0.254: v65.41,65.72 64.77,66.36 64.77,78.42 v65.41,79.06
ENC_A  (via drill 0.6)
  Top 0.254: v25.08,88.27 25.72,88.27 26.67,89.22 28.26,89.22 29.21,88.27 35.56,88.27 36.2,87.63 40.32,87.63 40.96,87 42.55,87 43.18,86.36 44.77,86.36 45.4,85.72 46.99,85.72 47.62,85.09 52.07,85.09 52.7,84.45 67.63,84.45 68.54,83.54 SW1.B | MCU1.EXT2-22 26.35,60.64 26.35,76.83 v25.72,77.47
  Bottom 0.254: v25.72,77.47 25.08,78.11 v25.08,88.27
ENC_B  (via drill 0.6)
  Top 0.254: v27.62,88.27 28.26,87.63 35.24,87.63 35.88,87 40.01,87 40.64,86.36 42.23,86.36 42.86,85.72 44.45,85.72 45.09,85.09 46.67,85.09 47.31,84.45 51.75,84.45 52.39,83.82 63.18,83.82 63.5,83.5 63.54,83.5 SW1.A | MCU1.EXT2-21 26.99,60.64 v26.99,79.06
  Bottom 0.254: 27.94,87.95 v27.62,88.27 27.62,79.69 v26.99,79.06
ENC_CLICK  (via drill 0.6)
  Top 0.254: v69.22,84.45 68.58,85.09 53.02,85.09 52.39,85.72 47.94,85.72 47.31,86.36 45.72,86.36 45.09,87 43.5,87 42.86,87.63 41.27,87.63 40.64,88.27 36.51,88.27 35.88,88.9 29.53,88.9 28.57,89.85 25.08,89.85 23.81,88.58 v20,88.58 | v20.95,79.38 24.13,79.38 24.77,78.74 24.77,76.83 25.72,75.88 25.72,66.99 24.45,65.72 24.45,63.18 MCU1.EXT2-24
  Bottom 0.254: v69.22,84.45 67.94,85.72 67.94,96.5 68.54,97.09 SW1.E | v20.95,79.38 20,80.33 v20,88.58
FM
  Top 0.254: R35.1 16.19,11.75 16.83,11.11 24.45,11.11 27.3,8.26 J3.P3
FM_CV
  Top 0.254: MCU1.EXT2-8 24.45,41.91 22.86,40.32 22.86,29.53 25.08,27.3 25.08,17.14 24.45,16.51 IC5.14 21.91,16.51 20.96,15.56 C15.2 R37.2
GATE
  Top 0.254: R23.1 32.07,34.29 31.11,33.34 Q5.C 30.97,33.02 25.72,33.02 25.4,33.34 MCU1.EXT2-2
GATE_IN
  Top 0.254: Q5.B 30.16,30.79 R22.2
GND  (via drill 0.6)
  Top 0.406: IC2.8 59.05,69.22 59.37,68.9 61.59,68.9 v61.59,69.53
  other vias: 6.67,100.33 13.65,102.23 21.91,102.23 54.93,95.25 73.03,69.85 53.98,78.11 66.67,78.11 7.3,86.04 51.75,87 1.27,23.5 1.27,31.11 1.91,46.99 1.91,53.34 1.27,61.59 1.27,69.22 1.27,76.83 1.27,104.78 40.32,104.78 47.94,104.78 69.85,104.78 77.47,92.08 77.47,84.45 77.47,76.83 77.47,69.22 77.47,61.59 77.47,53.98 77.47,46.35 1.27,99.69 1.27,92.08 11.11,93.34 62.23,104.78 1.27,84.45 77.47,38.73 77.47,31.37 1.27,15.88 1.27,8.26 1.27,1.27 77.47,1.27 77.47,10.48 8.89,1.27 69.85,1.27 62.23,1.27 54.61,1.27 46.99,1.27 39.37,1.27 31.75,1.27 24.13,1.27 16.51,1.27 62.87,79.69 57.78,90.17 66.04,90.17 70.48,79.06 50.16,78.11 26.67,31.75 54.93,99.38 54.93,92.71 73.03,87.31 30.48,90.81 16.83,45.72 59.69,43.81 9.53,53.34 9.53,50.16 9.53,46.99 1.91,50.16 60.33,19.68 49.53,21.27 44.13,13.65 5.71,46.99 45.09,33.66 61.28,32.07 12.06,23.5 12.06,15.88 41.91,23.81 18.41,29.84 33.66,38.73 45.09,38.73 33.66,46.35 33.66,53.98 45.09,46.35 45.09,53.98 59.69,53.98 31.75,76.83 33.66,69.22 71.12,31.43 56.2,43.81 34.61,19.05 20,21.27 52.07,32.07 57.15,61.59 28.89,82.23
  pour Bottom: 0,106.68 0,0 78.74,0 78.74,106.68
  pour Top (isolate 0.203): 0,106.68 0,0 78.74,0 78.74,106.68
LED1  (via drill 0.6)
  Top 0.254: v55.56,59.69 55.56,61.59 58.1,64.14 60.01,64.14 60.64,64.77 61.91,64.77 62.55,64.14 68.9,64.14 70.8,66.04 74.61,66.04 76.52,67.94 76.52,92.71 74.61,94.61 67.63,94.61 66.89,95.35 R2.1
  Bottom 0.254: MCU1.EXT1-12 53.66,52.07 55.56,53.98 v55.56,59.69
LED2  (via drill 0.6)
  Top 0.254: R1.2 6.35,28.26 6.99,28.89 6.99,31.43 12.06,36.51 v12.06,50.16 | v17.78,50.16 18.1,49.85 25.08,49.85 MCU1.EXT2-14
  Bottom 0.254: v12.06,50.16 v17.78,50.16
N$1
  Top 0.254: Q1.C 24.13,102.09 24.13,101.28 25.08,100.33 29.21,100.33 30.16,101.28 30.16,104.14 31.43,105.41 35.88,105.41 36.51,104.78 DISP1.16
N$2
  Top 0.254: DISP1.11 49.21,99.06 50.97,100.82 Q2.C
N$3
  Top 0.254: DISP2.16 11.11,99.06 10.48,99.69 9.21,99.69 7.47,101.43 Q3.C
N$4
  Top 0.254: DISP2.11 23.81,99.06 23.18,99.69 17.46,99.69 15.73,101.43 Q4.C
N$5
  Top 0.254: R18.2 28.16,101.28 Q1.B
N$6
  Top 0.254: R19.2 55.15,101.28 Q2.B
N$7
  Top 0.406: IC4.2 6.65,42.44 C6.+ 6.67,39.83 6.67,39.05 5.71,38.1 3.17,38.1 2.54,37.47 R49.1
N$9
  Top 0.254: Q3.B 9.77,101.39 R20.2
N$10
  Top 0.254: Q4.B 18.03,101.39 R21.2
N$13
  Top 0.61: JP1.10 JP1.9 71.75,16.19 70.81,15.24 D2.C
N$14
  Top 0.61: JP1.2 JP1.1 71.75,26.35 71.11,25.71 D1.A
N$15  (via drill 0.6)
  Top 0.254: R3.2 45.4,100.97 46.67,99.69 DISP1.12 46.67,97.16 42.86,93.34 21.59,93.34 v21.27,93.03
  Bottom 0.254: v21.27,93.03 DISP2.12
N$16  (via drill 0.6)
  Top 0.254: v26.35,92.39 26.67,92.71 44.13,92.71 47.94,96.52 51.12,96.52 51.75,97.16 DISP1.10 51.75,100.33 52.07,100.65 52.07,103.19 50.16,103.19 49.85,102.87 49.85,101.92 49.31,101.39 R4.2
  Bottom 0.254: v26.35,92.39 DISP2.10
N$17  (via drill 0.6)
  Top 0.254: v26.35,87.31 26.67,87 34.92,87 35.56,86.36 39.69,86.36 40.32,85.72 41.91,85.72 42.55,85.09 44.13,85.09 44.77,84.45 46.35,84.45 46.99,83.82 51.12,83.82 51.75,83.19 DISP1.9 51.75,82.87 R5.2
  Bottom 0.254: DISP2.9 v26.35,87.31
N$18  (via drill 0.6)
  Top 0.254: v20.95,86.68 21.27,86.36 34.61,86.36 35.24,85.72 39.37,85.72 40.01,85.09 41.59,85.09 42.23,84.45 43.81,84.45 44.45,83.82 46.04,83.82 46.67,83.19 DISP1.7 R6.2
  Bottom 0.254: v20.95,86.68 21.27,86.36 DISP2.7
N$19
  Top 0.254: R7.2 33.97,79.69 33.02,80.64 31.43,80.64 | 31.43,80.64 DISP1.1 | DISP2.1 6.03,81.92 7.3,80.64 31.43,80.64
N$20
  Top 0.254: R8.2 32.7,100.97 31.43,99.69 DISP1.18 31.43,97.16 30.8,96.52 6.67,96.52 6.03,97.16 DISP2.18
N$21  (via drill 0.6)
  Top 0.254: R9.2 35.24,100.97 33.97,99.69 DISP1.17 33.97,97.16 32.7,95.89 8.89,95.89 v8.57,95.57
  Bottom 0.254: v8.57,95.57 DISP2.17
N$22  (via drill 0.6)
  Top 0.254: R10.2 37.78,100.97 39.05,99.69 DISP1.15 39.05,97.16 37.15,95.25 13.97,95.25 v13.65,94.93
  Bottom 0.254: v13.65,94.93 DISP2.15
N$23  (via drill 0.6)
  Top 0.254: R11.2 40.32,100.97 41.59,99.69 DISP1.14 41.59,97.16 39.05,94.61 16.51,94.61 v16.19,94.3
  Bottom 0.254: v16.19,94.3 DISP2.14
N$24  (via drill 0.6)
  Top 0.254: v18.73,86.04 19.05,85.72 34.29,85.72 34.92,85.09 39.05,85.09 39.69,84.45 41.27,84.45 41.91,83.82 43.5,83.82 44.13,83.19 DISP1.6 R12.2
  Bottom 0.254: DISP2.6 v18.73,86.04
N$25  (via drill 0.6)
  Top 0.254: v16.19,85.41 16.51,85.09 33.97,85.09 34.61,84.45 38.73,84.45 39.37,83.82 40.96,83.82 41.59,83.19 DISP1.5 R13.2
  Bottom 0.254: DISP2.5 v16.19,85.41
N$26  (via drill 0.6)
  Top 0.254: v13.65,84.77 13.97,84.45 33.66,84.45 34.29,83.82 38.42,83.82 39.05,83.19 DISP1.4 R14.2
  Bottom 0.254: DISP2.4 v13.65,84.77
N$27
  Top 0.254: DISP2.2 8.57,83.19 9.21,83.82 33.34,83.82 33.97,83.19 DISP1.2 33.97,81.28 34.92,80.33 35.88,80.33 36.51,79.69 R15.2
N$28  (via drill 0.6)
  Top 0.254: R16.2 42.86,100.97 44.13,99.69 DISP1.13 44.13,97.16 40.96,93.98 19.05,93.98 v18.73,93.66
  Bottom 0.254: v18.73,93.66 DISP2.13
N$29  (via drill 0.6)
  Top 0.254: DISP1.8 49.21,81.92 49.85,81.28 R17.2 | v49.21,86.68 48.9,86.36 48.26,86.36 47.62,87 46.04,87 45.4,87.63 43.81,87.63 43.18,88.27 41.59,88.27 40.96,88.9 36.83,88.9 36.2,89.53 29.84,89.53 28.89,90.49 24.45,90.49 23.81,89.85 v23.5,89.85
  Bottom 0.254: DISP1.8 v49.21,86.68 | v23.5,89.85 23.81,89.53 DISP2.8
N$30  (via drill 0.6)
  Top 0.254: IC1.7 70.48,71.12 71.12,71.75 72.07,71.75 73.34,73.03 73.34,83.82 70.17,87 56.83,87 53.66,90.17 40.64,90.17 v40.32,89.85 | v40.32,99.69 39.05,100.97 39.05,102.55 38.52,103.08 R10.1
  Bottom 0.254: v40.32,89.85 v40.32,99.69
N$31  (via drill 0.6)
  Top 0.254: IC2.14 52.7,78.74 53.66,79.69 57.47,79.69 v58.74,78.42 | v59.05,73.66 59.37,73.98 70.8,73.98 71.75,74.93 IC1.9
  Bottom 0.254: v58.74,78.42 59.05,78.11 v59.05,73.66
N$32  (via drill 0.6)
  Top 0.254: IC1.15 64.14,79.38 64.77,80.01 69.85,80.01 70.8,80.96 70.8,85.41 69.85,86.36 56.52,86.36 53.98,88.9 49.53,88.9 v49.21,89.22 | v47.94,99.69 46.99,100.65 46.99,102.23 46.14,103.08 R3.1
  Bottom 0.254: v49.21,89.22 49.21,92.71 47.94,93.98 v47.94,99.69
N$33  (via drill 0.6)
  Top 0.254: IC1.1 62.87,68.58 66.99,68.58 68.26,67.31 73.98,67.31 75.25,68.58 75.25,92.08 73.98,93.34 58.1,93.34 v57.47,92.71 | v58.1,94.93 58.1,102.87 56.2,104.78 49.85,104.78 48.9,103.82 R4.1
  Bottom 0.254: v57.47,92.71 58.1,93.34 v58.1,94.93
N$34  (via drill 0.6)
  Top 0.254: v61.28,82.87 R5.1 | IC1.2 64.14,71.12 63.82,71.44 61.91,71.44 v61.59,71.12
  Bottom 0.254: v61.59,71.12 61.28,71.44 v61.28,82.87
N$35  (via drill 0.6)
  Top 0.254: IC1.3 65.41,71.12 64.45,72.07 54.29,72.07 53.02,73.34 49.85,73.34 48.9,74.3 47.31,74.3 v46.67,74.93 | v47.94,80.64 47.94,77.79 47.41,77.25 R6.1
  Bottom 0.254: v46.67,74.93 46.67,79.38 v47.94,80.64
N$36
  Top 0.254: IC1.4 66.67,71.12 65.09,72.71 54.93,72.71 53.66,73.98 50.16,73.98 49.21,74.93 48.26,74.93 46.99,76.2 34.29,76.2 33.97,76.52 R7.1
N$37  (via drill 0.6)
  Top 0.254: IC1.5 67.94,68.58 68.58,67.94 73.66,67.94 74.61,68.9 74.61,91.76 73.66,92.71 59.05,92.71 57.78,91.44 33.02,91.44 v32.7,91.12 | R8.1 32.8,103.19 33.34,103.19 33.97,102.55 33.97,100.97 v32.7,99.69
  Bottom 0.254: v32.7,91.12 v32.7,99.69
N$38  (via drill 0.6)
  Top 0.254: IC1.6 69.22,68.58 73.34,68.58 73.98,69.22 73.98,84.14 70.48,87.63 57.15,87.63 53.98,90.81 35.56,90.81 v35.24,90.49 | R9.1 35.24,103.82 34.92,104.14 v33.97,104.14
  Bottom 0.254: v35.24,90.49 35.24,102.87 v33.97,104.14
N$39  (via drill 0.6)
  Top 0.254: IC2.15 51.44,79.06 52.7,80.33 58.42,80.33 58.74,80.64 69.53,80.64 70.17,81.28 70.17,85.09 69.53,85.72 56.2,85.72 53.66,88.27 45.09,88.27 43.81,89.53 43.18,89.53 v42.86,89.22 | v42.86,99.69 41.59,100.97 41.59,102.55 41.06,103.08 R11.1
  Bottom 0.254: v42.86,89.22 v42.86,99.69
N$40  (via drill 0.6)
  Top 0.254: IC2.1 50.16,70.48 49.85,70.8 48.58,70.8 47.62,71.75 44.77,71.75 v44.45,72.07 | v45.4,80.64 45.4,77.79 44.87,77.25 R12.1
  Bottom 0.254: v44.45,72.07 45.4,73.03 v45.4,80.64
N$41  (via drill 0.6)
  Top 0.254: IC2.2 51.44,71.12 51.12,71.44 48.9,71.44 47.94,72.39 45.72,72.39 44.45,73.66 v42.86,73.66 | v42.86,80.64 42.86,77.79 42.33,77.25 R13.1
  Bottom 0.254: v42.86,73.66 v42.86,80.64
N$42  (via drill 0.6)
  Top 0.254: IC2.3 52.7,71.12 51.75,72.07 49.21,72.07 48.26,73.03 46.04,73.03 44.13,74.93 40.64,74.93 v40.32,74.61 | v40.32,80.64 40.32,77.79 39.79,77.25 R14.1
  Bottom 0.254: v40.32,74.61 v40.32,80.64
N$43  (via drill 0.6)
  Top 0.254: IC2.4 53.98,71.12 52.39,72.71 49.53,72.71 48.58,73.66 46.35,73.66 44.45,75.56 38.1,75.56 v37.78,75.25 | v37.78,80.64 37.78,77.79 37.25,77.25 R15.1
  Bottom 0.254: v37.78,75.25 v37.78,80.64
N$44  (via drill 0.6)
  Top 0.254: IC2.5 55.24,68.58 55.56,68.26 62.23,68.26 62.55,67.94 66.67,67.94 67.94,66.67 74.3,66.67 75.88,68.26 75.88,92.39 74.3,93.98 49.53,93.98 v47.94,92.39 | v45.4,99.69 44.13,100.97 44.13,102.55 43.6,103.08 R16.1
  Bottom 0.254: v47.94,92.39 45.4,94.93 v45.4,99.69
N$45
  Top 0.254: IC5.6 30.48,22.86 C9.1 R28.1 R25.2 R24.2
N$46  (via drill 0.6)
  Top 0.254: IC2.6 56.52,71.12 56.83,71.44 60.01,71.44 60.33,71.12 v60.33,70.48 | R17.1 60.01,81.28 v60.33,81.6
  Bottom 0.254: v60.33,70.48 v60.33,81.6
N$47
  Top 0.254: LED1.A 65.19,101.18 R2.2
N$48
  Top 0.254: R1.1 SW2.L1
N$50
  Top 0.254: R34.2 R35.2 R37.1 C15.1 20.32,17.78 IC5.13
N$52
  Top 0.254: IC5.2 30.48,17.78 C10.1 R29.1 R27.2 R26.2
N$57  (via drill 0.6)
  Top 0.254: v3.81,11.43 10.48,11.43 13.02,13.97 13.02,26.04 13.97,26.99 20.32,26.99 21.59,28.26 v21.91,28.26 | v25.08,30.16 27.94,30.16 29.21,28.89 R22.1
  Bottom 0.254: J1.P3 3.49,7.94 3.49,11.11 v3.81,11.43 | v21.91,28.26 23.81,30.16 v25.08,30.16
N$63
  Top 0.254: IC5.9 20.32,22.86 C16.1 R38.1 R33.2 R32.2
N$67
  Top 0.254: IC8.6 IC8.7 52.39,24.77 51.75,25.4 C19.2 47.31,26.04 45.72,24.45 C20.+
N$68
  Top 0.254: C20.- 45.72,18.73 46.99,17.46 R40.2
N$69
  Top 0.254: R39.1 C17.1 55.56,25.4 54.93,24.77 IC8.5
N$71
  Top 0.254: R36.1 R39.2 C19.1
N$72
  Top 0.254: J6.P3 69.85,4.45 69.85,8.57 67.31,11.11 58.42,11.11 56.83,12.7 54.61,12.7 | R44.1 50.8,13.02 51.12,12.7 54.61,12.7 | R43.1 54.61,12.7
N$73
  Top 0.254: C21.2 R44.2 51.12,16.19 IC8.1
N$75
  Top 0.254: R43.2 C21.1 53.02,16.19 53.02,16.51 52.39,17.14 IC8.2 52.39,20 52.07,20.32 49.85,20.32 49.53,20 R40.1
PARAM1_CV
  Top 0.254: R29.2 C10.2 29.84,15.56 28.89,16.51 IC5.1 26.35,16.51 25.72,17.14 25.72,27.62 23.5,29.84 23.5,40.01 24.45,40.96 26.99,40.96 MCU1.EXT2-7
PARAM2_CV  (via drill 0.6)
  Top 0.254: IC5.7 28.89,24.13 29.84,25.08 C9.2 R28.2 40.01,25.08 40.32,24.77 43.81,24.77 v46.04,26.99 | MCU1.EXT1-26 52.07,33.02 50.8,33.02 47.62,29.84 v46.04,29.84
  Bottom 0.254: v46.04,26.99 v46.04,29.84
PITCH_CV
  Top 0.254: R38.2 C16.2 20.95,25.08 21.91,24.13 IC5.8 23.81,24.13 24.45,24.77 24.45,26.99 22.23,29.21 22.23,40.64 25.4,43.81 MCU1.EXT2-10
SWITCH1  (via drill 0.6)
  Top 0.254: MCU1.EXT2-15 26.99,51.12 24.77,51.12 24.13,51.75 24.13,52.7 20.32,56.52 20.32,68.26 v19.68,68.9
  Bottom 0.254: S1.4 S1.3 19.68,70.21 v19.68,68.9
SWITCH2  (via drill 0.6)
  Top 0.254: SW2.P2 SW2.P5 8.85,19.41 7.62,20.64 7.62,31.11 12.7,36.2 12.7,47.94 v13.34,48.58 | MCU1.EXT2-13 26.99,48.58 24.77,48.58 24.13,49.21 18.41,49.21 17.78,48.58 v16.83,48.58
  Bottom 0.254: v16.83,48.58 v13.34,48.58
TIMBRE
  Top 0.254: J4.P3 40.01,8.26 37.15,11.11 35.24,11.11 34.61,11.75 R27.1
UART_LOGGER
  Top 0.254: TP1.P$1 MCU1.EXT1-13
VCC  (via drill 0.6)
  Top 0.406: 51.12,22.86 51.12,22.54 51.75,21.91 63.5,21.91 | 51.12,22.86 IC8.8 | 51.12,22.86 C13.1 | v63.5,20.95 63.5,21.91 | v65.72,10.16 65.72,3.81 64.45,2.54 5.08,2.54 3.49,4.13 3.49,6.99 2.54,7.94 R49.2 | 63.5,21.91 64.31,21.91 C4.+
  Top 0.61: C4.+ 67.63,23.81 D1.C
  Bottom 0.406: v63.5,20.95 63.5,14.29 65.72,12.06 v65.72,10.16
VEE  (via drill 0.6)
  Top 0.406: IC8.4 55.18,18.1 C14.2 56.52,17.14 v57.15,16.51 60.78,16.51 C5.- | v44.13,17.46 R31.1
  Top 0.61: D2.A 68.89,19.05 67.63,17.78 62.69,17.78 C5.-
  Bottom 0.406: v44.13,17.46 45.09,16.51 v57.15,16.51
VOCT
  Top 0.254: J2.P3 14.61,7.3 14.29,7.62 14.29,24.45 14.92,25.08 R33.1

### Text on the board
tNames: Plaits | Ah, buckle this! | DEBUG_PIN | UART_TX | Plaits v0.2 cc-by-sa Patrick Dowling, 2015 / Based on Braids by Olivier Gillet
bNames: Plaits | Ah, buckle this! | Plaits v0.2 cc-by-sa Patrick Dowling, 2015 / Based on Braids by Olivier Gillet | +12V | GND | GND | GND | -12V | Red stripe >